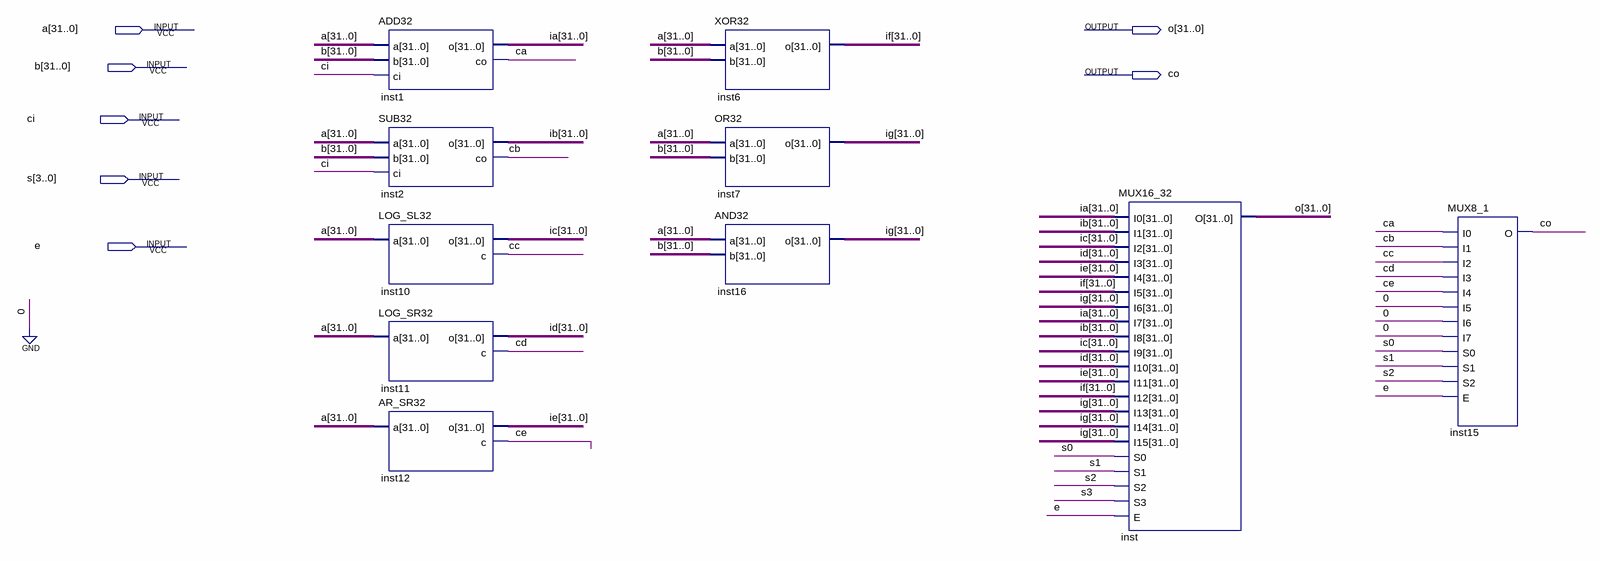
[diagram p0: schematic sheet]
// Quartus schematic ALU.bdf as structural Verilog: 10 symbols, 7 pins
module ALU (
  input  [31:0] a,
  input  [31:0] b,
  input  ci,
  input  [3:0] s,
  input  e,
  output [31:0] o,
  output co
);

  wire ca, cb, cc, cd, ce;
  wire [31:0] ia, ib, ic, id, ie, \if , ig;

  ADD32 inst1 (.a(a), .b(b), .ci(ci), .o(ia), .co(ca));
  SUB32 inst2 (.a(a), .b(b), .ci(ci), .o(ib), .co(cb));
  LOG_SL32 inst10 (.a(a), .o(ic), .c(cc));
  LOG_SR32 inst11 (.a(a), .o(id), .c(cd));
  AR_SR32 inst12 (.a(a), .o(ie), .c(ce));
  XOR32 inst6 (.a(a), .b(b), .o(\if ));
  OR32 inst7 (.a(a), .b(b), .o(ig));
  AND32 inst16 (.a(a), .b(b), .o(ig));
  MUX16_32 inst (
    .I0(ia), .I1(ib), .I2(ic), .I3(id), .I4(ie), .I5(\if ), .I6(ig), .I7(ia), .I8(ib), .I9(ic), .I10(id),
    .I11(ie), .I12(\if ), .I13(ig), .I14(ig), .I15(ig), .S0(s[0]), .S1(s[1]), .S2(s[2]), .S3(s[3]), .E(e),
    .O(o));
  MUX8_1 inst15 (
    .I0(ca), .I1(cb), .I2(cc), .I3(cd), .I4(ce), .I5(1'b0), .I6(1'b0), .I7(1'b0), .S0(s[0]), .S1(s[1]),
    .S2(s[2]), .E(e), .O(co));
endmodule
